# Altium schematic sheet Power.SchDoc
size A4
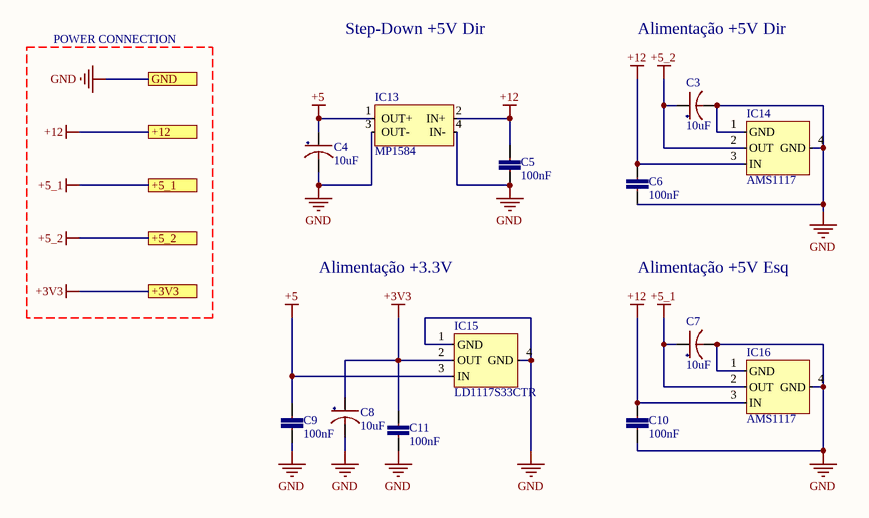
[diagram p0: Power.SchDoc]

## Parts
C3  10uF  [CAP ALUM 5X5]
C4  10uF  [CAP ALUM 5X5]
C5  100nF  [CAP CER 0603]
C6  100nF  [CAP CER 0603]
C7  10uF  [CAP ALUM 5X5]
C8  10uF  [CAP ALUM 5X5]
C9  100nF  [CAP CER 0603]
C10  100nF  [CAP CER 0603]
C11  100nF  [CAP CER 0603]
IC13  MP1584  [MP1584]
IC14  AMS1117  [SOT-223]
IC15  LD1117S33CTR  [SOT-223]
IC16  AMS1117  [SOT-223]

## Ports
+3V3, +5_1, +5_2, +12, GND

## Nets
+3V3: C8.1 C11.2 IC15.2(OUT) ; port +3V3
+5: C4.1 C9.2 IC13.1(OUT+) IC15.3(IN)
+5_1: C7.1 IC16.2(OUT) ; port +5_1
+5_2: C3.1 IC14.2(OUT) ; port +5_2
+12: C5.2 C6.2 C10.2 IC13.2(IN+) IC14.3(IN) IC16.3(IN) ; port +12
GND: C3.2 C4.2 C5.1 C6.1 C7.2 C8.2 C9.1 C10.1 C11.1 IC13.3(OUT-) IC13.4(IN-) IC14.1(GND) IC14.4(GND) IC15.1(GND) IC15.4(GND) IC16.1(GND) IC16.4(GND) ; port GND

## Notes on the sheet
- POWER CONNECTION
- Step-Down +5V Dir
- Alimentação +5V Dir
- Alimentação +3.3V
- Alimentação +5V Esq

## Library data of the parts
C3 C4 C7 C8 = CAP ALUM 25V 10uF: Aluminum Electrolytic Capacitors - SMD 25volts 10uF 5x5.4 20%; Mfr: Nichion; Mfr Nr: UWX1E100MCL1GB; Voltage Rating: 25V; Type: Surface Mount Aluminum Electrolytic Capacitor; Dimensions: 5x5mm; Series: UWX; Value: 10uF
C5 C6 C9-C11 = CAP CER 0603 25V 100nF: Multilayer Ceramic Capacitors MLCC - SMD/SMT 25V 0.1uF 0603 Y5V -20/+80%; Mfr Nr: C0603C104Z3VACTU; Mfr: KEMET; Type: Ceramic Capacitor; Dimensions: 0603 (1608 metric); Voltage Rating: 25V; Series: SMD Comm Y5V; Value: 100nF
IC14 IC16 = AMS1117: LDO Voltage Regulators 5V 1A; Mfr: STMicroelectronics; Series: LD1117; Package: SOT-223-3
IC15 = LD1117S33CTR: LDO Voltage Regulators 3.3V 0.8A Positive; Mfr: STMicroelectronics; Series: LD1117; Package: SOT-223-3